# Altium schematic sheet PWM_OUT.SchDoc: STM32F446 CNC
size B; Author: AM; CompanyName: Expatria Technologies; DrawnBy: A.Marles; Engineer: AM; Organization: Expatria Technolgoies; DocumentNumber: 5; SheetNumber: 5; SheetTotal: 14
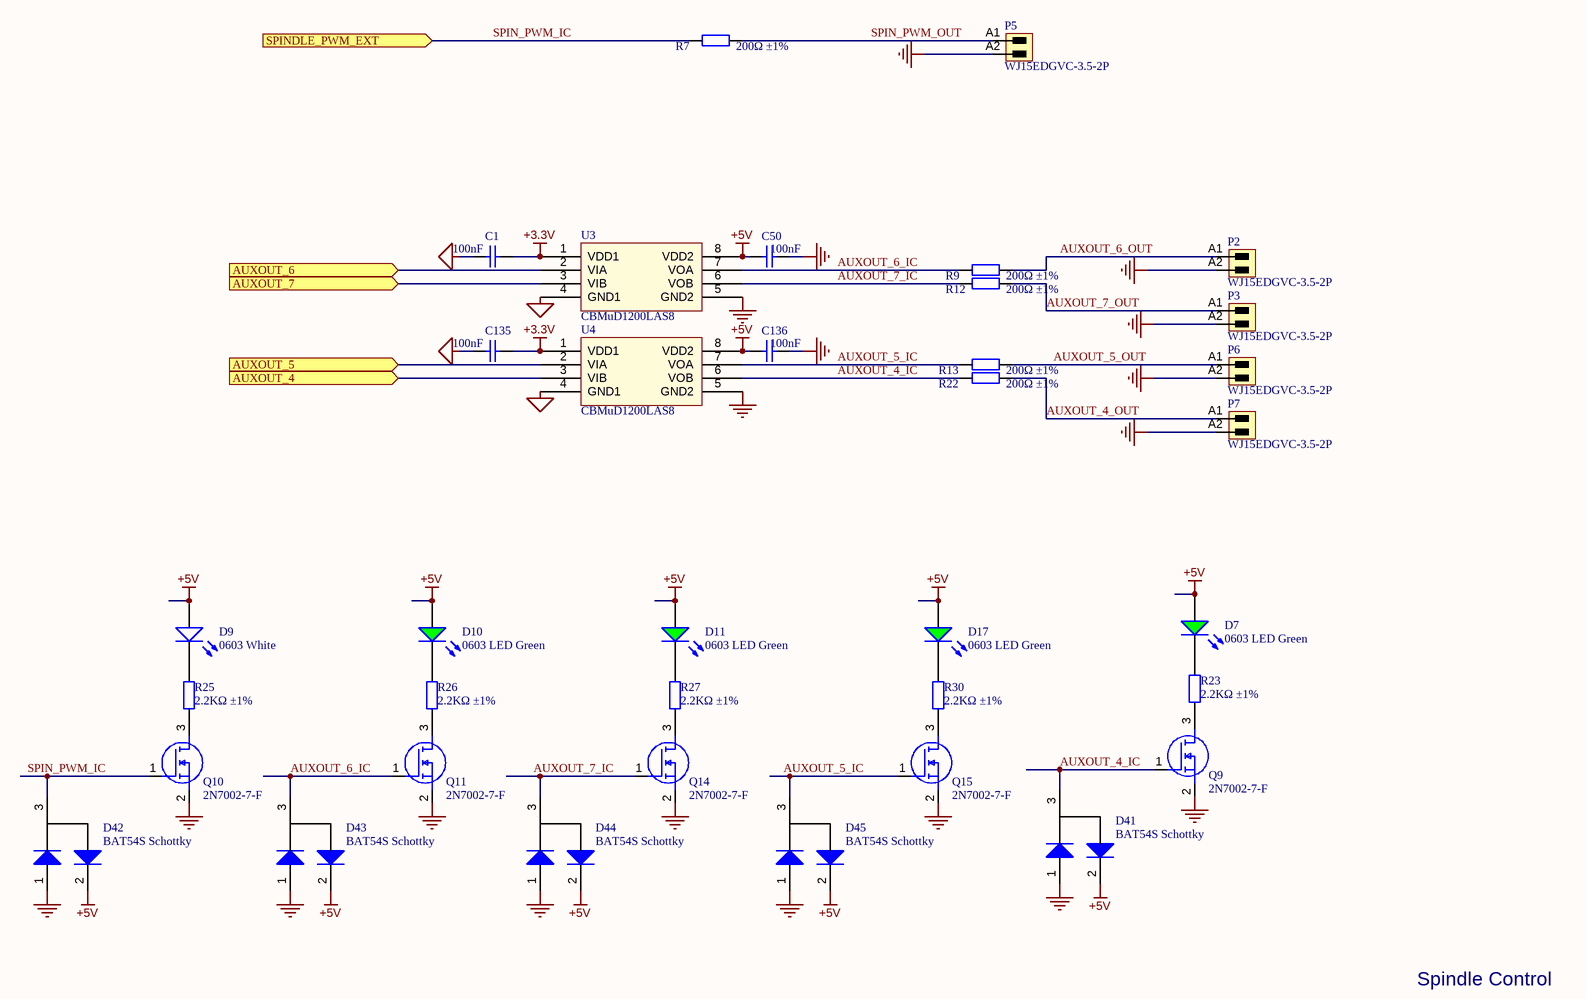
[diagram p0: PWM_OUT.SchDoc]

## Parts
C1  100nF  [0402_C]
C50  100nF  [0402_C]
C135  100nF  [0402_C]
C136  100nF  [0402_C]
D7  0603 LED Green  [0603_LED_S1 - GREEN]
D9  0603 White  [0603_LED_S1 - white]
D10  0603 LED Green  [0603_LED_S1 - GREEN]
D11  0603 LED Green  [0603_LED_S1 - GREEN]
D17  0603 LED Green  [0603_LED_S1 - GREEN]
D41  BAT54S Schottky  [SOT-23(SOT-23-3)]
D42  BAT54S Schottky  [SOT-23(SOT-23-3)]
D43  BAT54S Schottky  [SOT-23(SOT-23-3)]
D44  BAT54S Schottky  [SOT-23(SOT-23-3)]
D45  BAT54S Schottky  [SOT-23(SOT-23-3)]
P2  WJ15EDGVC-3.5-2P  [691321100002]
P3  WJ15EDGVC-3.5-2P  [691321100002]
P5  WJ15EDGVC-3.5-2P  [691321100002]
P6  WJ15EDGVC-3.5-2P  [691321100002]
P7  WJ15EDGVC-3.5-2P  [691321100002]
Q9  2N7002-7-F  [SOT-23(SOT-23-3)]
Q10  2N7002-7-F  [SOT-23(SOT-23-3)]
Q11  2N7002-7-F  [SOT-23(SOT-23-3)]
Q14  2N7002-7-F  [SOT-23(SOT-23-3)]
Q15  2N7002-7-F  [SOT-23(SOT-23-3)]
R7  200Ω ±1%  [0402_R]
R9  200Ω ±1%  [0402_R]
R12  200Ω ±1%  [0402_R]
R13  200Ω ±1%  [0402_R]
R22  200Ω ±1%  [0402_R]
R23  2.2KΩ ±1%  [0402_R]
R25  2.2KΩ ±1%  [0402_R]
R26  2.2KΩ ±1%  [0402_R]
R27  2.2KΩ ±1%  [0402_R]
R30  2.2KΩ ±1%  [0402_R]
U3  CBMuD1200LAS8  [SOIC-8_150mil]
U4  CBMuD1200LAS8  [SOIC-8_150mil]

## Ports
AUXOUT_4 (in), AUXOUT_5 (in), AUXOUT_6 (in), AUXOUT_7 (in), SPINDLE_PWM_EXT (in)

## Nets
+3.3V: C1.1 C135.1 U3.1(VDD1) U4.1(VDD1)
+5V: C50.2 C136.2 D7.A D9.A D10.A D11.A D17.A D41.2(A) D42.2(A) D43.2(A) D44.2(A) D45.2(A) U3.8(VDD2) U4.8(VDD2)
GND: C50.1 C136.1 D41.1(A) D42.1(A) D43.1(A) D44.1(A) D45.1(A) P2.A2 P3.A2 P5.A2 P6.A2 P7.A2 Q9.2(S) Q10.2(S) Q11.2(S) Q14.2(S) Q15.2(S) U3.5(GND2) U4.5(GND2)
MCU_GND: C1.2 C135.2 U3.4(GND1) U4.4(GND1)
AUXOUT_4: U4.3(VIB) ; port AUXOUT_4
AUXOUT_4_IC: D41.3(K) Q9.1(G) R22.1 U4.6(VOB)
AUXOUT_4_OUT: P7.A1 R22.2
AUXOUT_5: U4.2(VIA) ; port AUXOUT_5
AUXOUT_5_IC: D45.3(K) Q15.1(G) R13.1 U4.7(VOA)
AUXOUT_5_OUT: P6.A1 R13.2
AUXOUT_6: U3.2(VIA) ; port AUXOUT_6
AUXOUT_6_IC: D43.3(K) Q11.1(G) R9.1 U3.7(VOA)
AUXOUT_6_OUT: P2.A1 R9.2
AUXOUT_7: U3.3(VIB) ; port AUXOUT_7
AUXOUT_7_IC: D44.3(K) Q14.1(G) R12.1 U3.6(VOB)
AUXOUT_7_OUT: P3.A1 R12.2
SPIN_PWM_IC: D42.3(K) Q10.1(G) R7.1 ; port SPINDLE_PWM_EXT
SPIN_PWM_OUT: P5.A1 R7.2
NetD7_K: D7.K R23.2
NetD9_K: D9.K R25.2
NetD10_K: D10.K R26.2
NetD11_K: D11.K R27.2
NetD17_K: D17.K R30.2
NetQ9_3: Q9.3(D) R23.1
NetQ10_3: Q10.3(D) R25.1
NetQ11_3: Q11.3(D) R26.1
NetQ14_3: Q14.3(D) R27.1
NetQ15_3: Q15.3(D) R30.1

## Notes on the sheet
- Spindle Control
- SHEET
- Expatria Technologies
- 1136 Glade Court
- Port Coquitlam, BC V3B 1R5
- PROJECT
- SIZE
- ENGR
- MODIFIED
- DOCUMENT
- REV
- Copyright Expatria Technologies 2022. This document describes Open Hardware and is licensed under the CERN-OHL-S v2. No warranty is implied or expressed.
- EMAIL: INFO@EXPATRIA.CA
- B
- /

## Library data of the parts
C1 C50 C135 C136 = 0402 100nF (104) 10% 16V: Chip capacitors; Manufacturer: Samsung Electro-Mechanics; PartNumber: CL05B104KO5NNNC; Tolerance: 10%; Voltage: 16V; ComponentLink1Description: Supplier link; ComponentLink1URL: http://www.szlcsc.com/product/details_1877.html; Package: 0402; Supplier: LC; SuppliersPartNumber: C1525; Capacitance: 100nF
D7 D10 D11 D17 = 19-217/GHC-YR1S2/3T: Colorless transparence -40℃~+85℃ 520nm~535nm Emerald 120° 110mW 0603 Light Emitting Diodes (LED) ROHS; Manufacturer: Everlight Elec; Package: 0603; Supplier: LC; SuppliersPartNumber: C72043; Color: Green; Manufacturer Part Number: 19-217/GHC-YR1S2/3T
D9 = 0603 LED White: LED; Package: 0603; Supplier: LC; SuppliersPartNumber: C219227; Color: White; ComponentLink1Description: 供应商链接; ComponentLink1URL: http://www.szlcsc.com/product/details_2663.html
D41-D45 = SOT-23 BAT54S: 30V Dual 200mA 800mV@100mA SOT-23 Schottky Barrier Diodes (SBD) ROHS; ComponentLink1Description: 供应商链接; ComponentLink1URL: http://www.szlcsc.com/product/details_2877.html; Package: SOT-23; Supplier: LC; SuppliersPartNumber: C916425
P2 P3 P5-P7 = 3.5mm Terminal Header 2p: Header,Male Pin,Covered(4 Sided) 2 1 0.138"（3.50mm） 2 P=3.5mm Pluggable System Terminal Block RoHS; Manufacturer: Weidmueller; Manufacturer 1: Weidmuller; Manufacturer Part Number 1: 1604470000; UL_94_flammability_rating: V-0; Pitch_mm: 3.5 mm; Side_termination_characteristic: closed side; Pitch_inch: 0.138 inch; Solder_pin_length_mm: 3.2 mm; Short_text_for_material: SL 3.50/02/180G 3.2SN OR BX; ComponentLink1Description: Manufacturer URL; ComponentLink1URL: http://www.weidmueller.com/; PartNumber: WJ15EDGVC-3.5-2P; Revision: V1; PackageReference: SL_3_50_180G_02; Packaging: Box; SuppliersPartNumber: C192777
Q9-Q11 Q14 Q15 = 2N7002-7-F: 60V 115mA 7.5Ω@5V,50mA 370mW N Channel SOT-23 MOSFETs ROHS; Manufacturer: Diodes Inc.; SuppliersPartNumber: C85049; Manufacturer Part Number: 2N7002-7-F; Value: 2N7002-7-F; Datasheet Link: https://datasheet.datasheetarchive.com/originals/distributors/SFDatasheet-0/sf-0003625.pdf; Height: 1.2mm; Manufacturer_Part_Number: 2N7002-7-F; Mouser Part Number: 621-2N7002-F; Mouser Price/Stock: https://www.mouser.co.uk/ProductDetail/Diodes-Incorporated/2N7002-7-F?qs=jMXWnm70%252BC%252BAX%252BMLzUkTZg%3D%3D; Arrow Part Number: 2N7002-7-F; Arrow Price/Stock: https://www.arrow.com/en/products/2n7002-7-f/diodes-incorporated?region=nac
R7 R9 R12 R13 R22 = 0402 200R (2000) 1%: Chip resistor; Manufacturer: Uniroyal Elec; PartNumber: 0402WGF2000TCE; Power: 1/16W; ComponentLink1Description: Supplier link; ComponentLink1URL: http://www.szlcsc.com/product/details_25830.html; Package: 0402; Supplier: LC; SuppliersPartNumber: C25087; Resistance: 200Ω; Tolerance: 1%
R23 R25-R27 R30 = 0402 2.2K (2201) 1%: Chip resistor; Manufacturer: Uniroyal Elec; PartNumber: 0402WGF2201TCE; Power: 1/16W; ComponentLink1Description: Supplier link; ComponentLink1URL: http://www.szlcsc.com/product/details_26622.html; Package: 0402; Supplier: LC; SuppliersPartNumber: C25879; Resistance: 2.2KΩ; Tolerance: 1%
U3 U4 = CBMuD1200LAS8: Dual Channel Isolator; ComponentLink1Description: 供应商链接; ComponentLink1URL: http://www.szlcsc.com/product/details_10199.html; Package: SOIC-8_150mil; Supplier: LC; SuppliersPartNumber: C476470